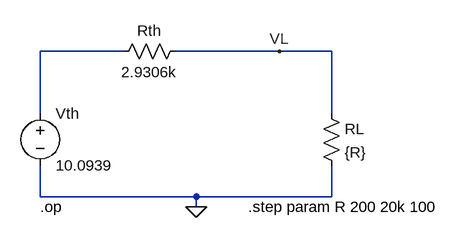
[diagram p0: schematic Circuit - 8.asc]
Circuit - 8.asc, the LTspice schematic file:
Version 4
SHEET 1 880 680
WIRE 176 32 48 32
WIRE 416 32 256 32
WIRE 496 32 416 32
WIRE 48 128 48 32
WIRE 496 128 496 32
WIRE 48 256 48 208
WIRE 288 256 48 256
WIRE 496 256 496 208
WIRE 496 256 288 256
WIRE 288 272 288 256
FLAG 288 272 0
FLAG 416 32 VL
SYMBOL voltage 48 112 R0
SYMATTR InstName Vth
SYMATTR Value 10.0939
SYMBOL res 272 16 R90
WINDOW 0 0 56 VBottom 2
WINDOW 3 32 56 VTop 2
SYMATTR InstName Rth
SYMATTR Value 2.9306k
SYMBOL res 480 112 R0
SYMATTR InstName RL
SYMATTR Value {R}
TEXT 368 272 Left 2 !.step param R 200 20k 100
TEXT 48 272 Left 2 !.op

The netlist it stands for:
* Circuit - 8.asc
Vth N001 0 10.0939
Rth VL N001 2.9306k
RL VL 0 {R}
.step param R 200 20k 100
.op
.backanno
.end

* Results of the author's LTspice run, read from the files saved beside the schematic
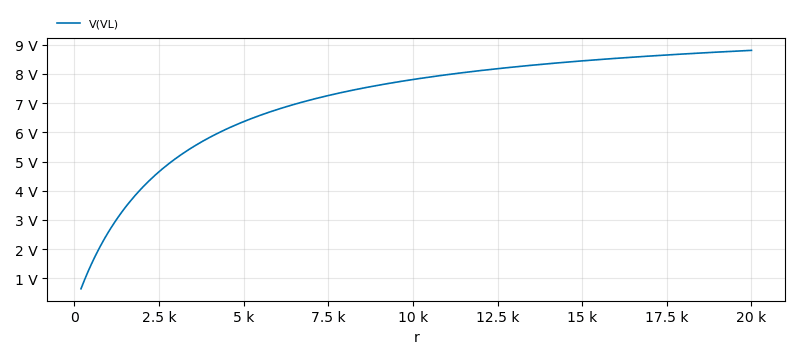
[diagram p1: Operating Point of Circuit - 8.asc, plotted from the saved traces]
* Operating Point, 1 run:
*   V(VL): 644.9 mV at r=200 , 8.804 V at r=20 k, min 644.9 mV, max 8.804 V